# Altium schematic sheet AUDIO_CODEC.SchDoc: AUDIO CODEC
size A3; Author: Silvio Navaretti; CompanyName: ARDUINO; DrawnBy: Silvio Navaretti; Engineer: Silvio Navaretti; Organization: ARDUINO; SheetNumber: 47; SheetTotal: 51; RevAuthor: Silvio Navaretti
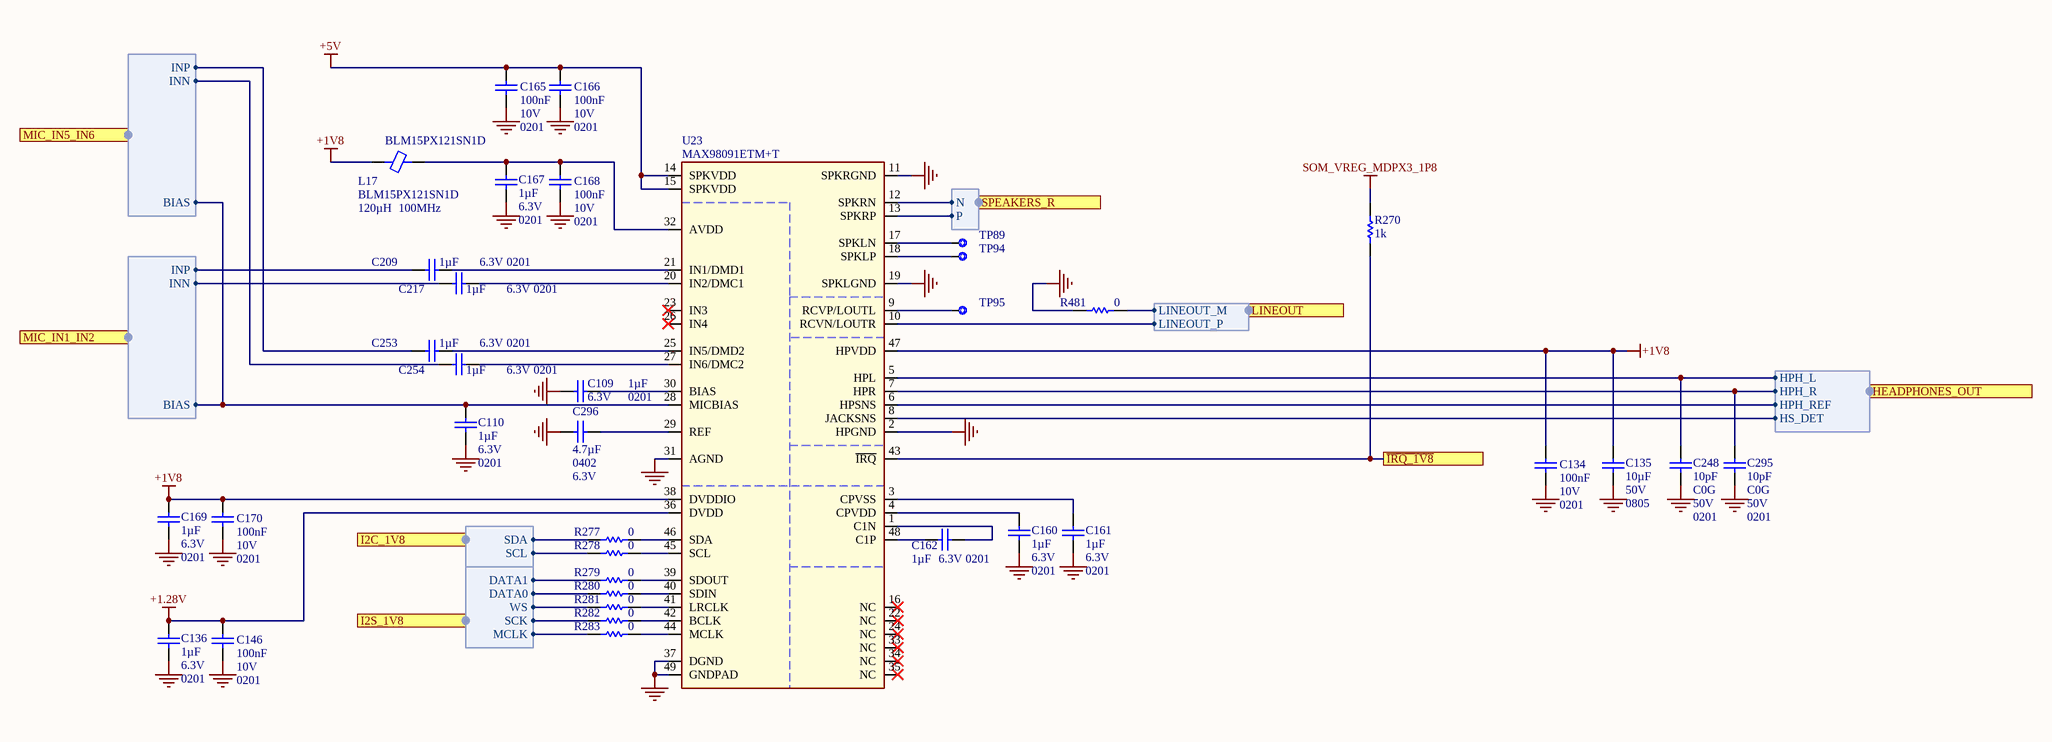
[diagram p0: AUDIO_CODEC.SchDoc]

## Parts
C109  value 1µF  Voltage: 6.3V  Case Code (Imperial): 0201  [CAP-0201]  (hidden comment: GRM033R60J105MEA2D)
C110  value 1µF  Voltage: 6.3V  Case Code (Imperial): 0201  [CAP-0201]  (hidden comment: GRM033R60J105MEA2D)
C134  value 100nF  Voltage: 10V  Case Code (Imperial): 0201  [CAP-0201]  (hidden comment: CL03A104KP3NNNC)
C135  value 10µF  Voltage: 50V  Case Code (Imperial): 0805  [CAP-0805]  (hidden comment: GRM21BR61H106ME43L)
C136  value 1µF  Voltage: 6.3V  Case Code (Imperial): 0201  [CAP-0201]  (hidden comment: GRM033R60J105MEA2D)
C146  value 100nF  Voltage: 10V  Case Code (Imperial): 0201  [CAP-0201]  (hidden comment: CL03A104KP3NNNC)
C160  value 1µF  Voltage: 6.3V  Case Code (Imperial): 0201  [CAP-0201]  (hidden comment: GRM033R60J105MEA2D)
C161  value 1µF  Voltage: 6.3V  Case Code (Imperial): 0201  [CAP-0201]  (hidden comment: GRM033R60J105MEA2D)
C162  value 1µF  Voltage: 6.3V  Case Code (Imperial): 0201  [CAP-0201]  (hidden comment: GRM033R60J105MEA2D)
C165  value 100nF  Voltage: 10V  Case Code (Imperial): 0201  [CAP-0201]  (hidden comment: CL03A104KP3NNNC)
C166  value 100nF  Voltage: 10V  Case Code (Imperial): 0201  [CAP-0201]  (hidden comment: CL03A104KP3NNNC)
C167  value 1µF  Voltage: 6.3V  Case Code (Imperial): 0201  [CAP-0201]  (hidden comment: GRM033R60J105MEA2D)
C168  value 100nF  Voltage: 10V  Case Code (Imperial): 0201  [CAP-0201]  (hidden comment: CL03A104KP3NNNC)
C169  value 1µF  Voltage: 6.3V  Case Code (Imperial): 0201  [CAP-0201]  (hidden comment: GRM033R60J105MEA2D)
C170  value 100nF  Voltage: 10V  Case Code (Imperial): 0201  [CAP-0201]  (hidden comment: CL03A104KP3NNNC)
C209  value 1µF  Voltage: 6.3V  Case Code (Imperial): 0201  [CAP-0201]  (hidden comment: GRM033R60J105MEA2D)
C217  value 1µF  Voltage: 6.3V  Case Code (Imperial): 0201  [CAP-0201]  (hidden comment: GRM033R60J105MEA2D)
C248  value 10pF  Dielectric: C0G  Voltage: 50V  Case Code (Imperial): 0201  [CAP-0201]  (hidden comment: CC0201GRNPO9BN100)
C253  value 1µF  Voltage: 6.3V  Case Code (Imperial): 0201  [CAP-0201]  (hidden comment: GRM033R60J105MEA2D)
C254  value 1µF  Voltage: 6.3V  Case Code (Imperial): 0201  [CAP-0201]  (hidden comment: GRM033R60J105MEA2D)
C295  value 10pF  Dielectric: C0G  Voltage: 50V  Case Code (Imperial): 0201  [CAP-0201]  (hidden comment: CC0201GRNPO9BN100)
C296  value 4.7µF  Case Code (Imperial): 0402  Voltage: 6.3V  [CAP-0402]  (hidden comment: C1005A475M6R3NT)
L17  BLM15PX121SN1D  Inductance: 120µH  Test Frequency: 100MHz  [L-0402]
R270  value 1k  [RES-0201]  (hidden comment: RC0201FR-071KL)
R277  value 0  [RES-0201]  (hidden comment: CRCW02010000Z0ED)
R278  value 0  [RES-0201]  (hidden comment: CRCW02010000Z0ED)
R279  value 0  [RES-0201]  (hidden comment: CRCW02010000Z0ED)
R280  value 0  [RES-0201]  (hidden comment: CRCW02010000Z0ED)
R281  value 0  [RES-0201]  (hidden comment: CRCW02010000Z0ED)
R282  value 0  [RES-0201]  (hidden comment: CRCW02010000Z0ED)
R283  value 0  [RES-0201]  (hidden comment: CRCW02010000Z0ED)
R481  value 0  [RES-0201]  (hidden comment: CRCW02010000Z0ED)
TP89  Test point 1.00mm  [TP-1.00MM]  (value not drawn)  (no BOM)
TP94  Test point 1.00mm  [TP-1.00MM]  (value not drawn)  (no BOM)
TP95  Test point 1.00mm  [TP-1.00MM]  (value not drawn)  (no BOM)
U23  MAX98091ETM+T  [QFN127P600-8N]

## Ports
HEADPHONES_OUT (harness HEADPHONES), I2C_1V8 (harness I2C), I2S_1V8 (harness SOM_MD_I2S_QUA), LINEOUT (harness LINEOUT), MIC_IN1_IN2 (harness MIC), MIC_IN5_IN6 (harness MIC), SPEAKERS_R (harness SPEAKERS), ~{IRQ_1V8}

## Harnesses
I2C: SDA, SCL
HEADPHONES: HPH_L, HPH_R, HPH_REF, HS_DET
MIC: INP, INN, BIAS
SPEAKERS: N, P
SOM_MD_I2S_QUA: SCK, WS, DATA0, DATA1, MCLK
LINEOUT: LINEOUT_P, LINEOUT_M

## Nets
+1.28V: C136.2 C146.2 U23.36(DVDD)
+1V8: C134.2 C135.1 C169.2 C170.2 L17.1 U23.38(DVDDIO) U23.47(HPVDD)
+5V: C165.2 C166.2 U23.14(SPKVDD) U23.15(SPKVDD)
GND: C109.1 C110.1 C134.1 C135.2 C136.1 C146.1 C160.1 C161.1 C165.1 C166.1 C167.1 C168.1 C169.1 C170.1 C248.1 C295.1 C296.2 R481.1 U23.2(HPGND) U23.11(SPKRGND) U23.19(SPKLGND) U23.31(AGND) U23.37(DGND) U23.49(GNDPAD)
SOM_VREG_MDPX3_1P8: R270.2
~{IRQ_1V8}: R270.1 U23.43(~{IRQ}) ; port ~{IRQ_1V8}
NetC109_2: C109.2 U23.30(BIAS)
NetC110_2: C110.2 U23.28(MICBIAS) ; port MIC_IN1_IN2.BIAS, port MIC_IN5_IN6.BIAS
NetC160_2: C160.2 U23.4(CPVDD)
NetC161_2: C161.2 U23.3(CPVSS)
NetC162_1: C162.1 U23.1(C1N)
NetC162_2: C162.2 U23.48(C1P)
NetC167_2: C167.2 C168.2 L17.2 U23.32(AVDD)
NetC209_1: C209.1 U23.21(IN1/DMD1)
NetC209_2: C209.2 ; port MIC_IN1_IN2.INP
NetC217_1: C217.1 U23.20(IN2/DMC1)
NetC217_2: C217.2 ; port MIC_IN1_IN2.INN
NetC248_2: C248.2 U23.5(HPL) ; port HEADPHONES_OUT.HPH_L
NetC253_1: C253.1 U23.25(IN5/DMD2)
NetC253_2: C253.2 ; port MIC_IN5_IN6.INP
NetC254_1: C254.1 U23.27(IN6/DMC2)
NetC254_2: C254.2 ; port MIC_IN5_IN6.INN
NetC295_2: C295.2 U23.7(HPR) ; port HEADPHONES_OUT.HPH_R
NetC296_1: C296.1 U23.29(REF)
NetR277_1: R277.1 ; port I2C_1V8.SDA
NetR277_2: R277.2 U23.46(SDA)
NetR278_1: R278.1 ; port I2C_1V8.SCL
NetR278_2: R278.2 U23.45(SCL)
NetR279_1: R279.1 ; port I2S_1V8.DATA1
NetR279_2: R279.2 U23.39(SDOUT)
NetR280_1: R280.1 ; port I2S_1V8.DATA0
NetR280_2: R280.2 U23.40(SDIN)
NetR281_1: R281.1 ; port I2S_1V8.WS
NetR281_2: R281.2 U23.41(LRCLK)
NetR282_1: R282.1 ; port I2S_1V8.SCK
NetR282_2: R282.2 U23.42(BCLK)
NetR283_1: R283.1 ; port I2S_1V8.MCLK
NetR283_2: R283.2 U23.44(MCLK)
NetR481_2: R481.2 ; port LINEOUT.LINEOUT_M
NetTP89_X: TP89.X U23.17(SPKLN)
NetTP94_X: TP94.X U23.18(SPKLP)
NetTP95_X: TP95.X U23.9(RCVP/LOUTL)
NetU23_6: U23.6(HPSNS) ; port HEADPHONES_OUT.HPH_REF
NetU23_8: U23.8(JACKSNS) ; port HEADPHONES_OUT.HS_DET
NetU23_10: U23.10(RCVN/LOUTR) ; port LINEOUT.LINEOUT_P
NetU23_12: U23.12(SPKRN) ; port SPEAKERS_R.N
NetU23_13: U23.13(SPKRP) ; port SPEAKERS_R.P

Not connected (* = marked no-connect by the designer): U23 16(NC)* 22(NC)* 23(IN3)* 24(NC)* 26(IN4)* 33(NC)* 34(NC)* 35(NC)*

## Notes on the sheet
- Title:
- ID:
- Date:
- Time:
- Version:
- Sheet
- of
- RevAuthor:
- Reference Designs ARE PROVIDED "AS IS" AND "WITH ALL FAULTS. Arduino SA DISCLAIMS ALL OTHER WARRANTIES, EXPRESS OR IMPLIED, REGARDING PRODUCTS, INCLUDING BUT NOT LIMITED TO, ANY IMPLIED WARRANTIES OF MERCHANTABILITY OR FITNESS FOR A PARTICULAR PURPOSE.
  Arduino SA may make changes to specifications and product descriptions at any time, without notice. The Customer must not rely on the absence or characteristics of any features or instructions marked "reserved" or "undefined".
  Arduino SA reserves these for future definition and shall have no responsibility whatsoever for conflicts or incompatibilities arising from future changes to them. The product information on the Web Site or Materials is subject to change without notice.
  Do not finalize a design with this info. ARDUINO and other Arduino brands and logos and Trademarks of Arduino SA. All Arduino SA Trademarks cannot be used without owner's formal permission.
- File:
- Author:

## Library data of the parts
C109 C110 C136 C160-C162 C167 C169 C209 C217 C253 C254 = C0002-A.15: CAP CHIP 0201 1uF 20% 6.3V X5R; Manufacturer: Murata; Code Arduino: A5520; Tolerance: 20%; Dielectric: X5R; Part Number: GRM033R60J105MEA2D; Technology: Ceramic
C134 C146 C165 C166 C168 C170 = C0113-A.6: CAP CHIP 0201 100nF 10% 10V X5R; Manufacturer: Samsung Electro-Mechanics; Code Arduino: C0113; Technology: Ceramic; Part Number: CL03A104KP3NNNC; Dielectric: X5R; Tolerance: 10%
C135 = C0158-A.3: CAP CHIP 0805 10uF 20% 50V X5R; Manufacturer: Murata Electronics; Code Arduino: C0158; Technology: SMD; Dielectric: X5R; Tolerance: 20%; Part Number: GRM21BR61H106ME43L
C248 C295 = C0144-A.3: CAP CHIP 0201 10pF 5% 50V C0G; Manufacturer: Yageo; Code Arduino: C0144; Price: 0.005; Technology: Ceramic; Tolerance: 5%; Part Number: CC0201GRNPO9BN100
C296 = C0037-A.14: CAP CHIP 0402 4.7uF 20% 6V3 X5R; Manufacturer: Hottech; Code Arduino: 0833; Dielectric: X5R; Technology: Ceramic; Part Number: C1005A475M6R3NT; Manufacturer 2: Samsung Electro-Mechanics; Tolerance: 20%; Manufacturer 3: Murata Electronics; Part number 3: GRM155R60J475ME47D; Part number 2: CL05A475KQ5NRNC
L17 = I0028-A.10: FERRITE SMD 0402 120Ohm 25% 100MHz Ferrite 2A; Manufacturer: Murata; DC Resistance (DCR): 55mR; Code Arduino: I0028; Value: 120µH; Device Type: Ferrite; Packaging: Tape and Reel; Case Code (Imperial): 0402; Max DC Current: 2A; Case Code (Metric): 1005; Package Quantity: 10000; Current: 2A; Max Operating Temperature: 125°C; Tolerance: 25%; Min Operating Temperature: -55°C; Part Number: BLM15PX121SN1D
R270 = R0195-A.22: RES CHIP 0201 1k 1% 1/20W; Manufacturer: Yageo; Power: 50mW; Temperature coefficient: 200ppm; Code Arduino: R0195; Tolerance: 1%; Case Code (Imperial): 0201; Part Number: RC0201FR-071KL; Technology: Thick film
R277-R283 R481 = R0140-A.21: RES CHIP 0201 0R; Manufacturer: Vishay; Temperature coefficient: 0ppm; Code Arduino: R0140; Power: 50mW; Tolerance: 0%; Technology: Thick film; Case Code (Imperial): 0201; Part Number: CRCW02010000Z0ED
TP89 TP94 TP95 = UT0013-A.6: Part Number: This is not a component; Design Item ID: CMP-018-0005-A.3; Source: ut.SchLib; Manufacturer: This is not a component; Code Arduino: This is not a component; Pin Count: 1
U23 = U0313-A.5: CODEC Audio CODEC, 4 IN microphone, stereo speaker out 3.2W, stereo headphone out, line output, I2C+I2S, QFN48 6x6; Manufacturer: Analog Devices; Code Arduino: U0313; Part Number: MAX98091ETM+T